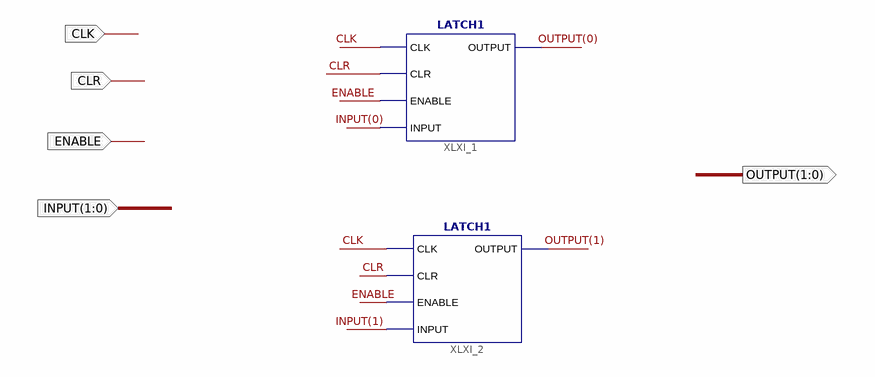
[diagram p0: schematic sheet 1]
// Xilinx ISE schematic LATCH2.sch (artix7) as structural Verilog: 2 symbols, 5 ports
module LATCH2 (
  input  CLK,
  input  CLR,
  input  ENABLE,
  input  [1:0] INPUT,
  output [1:0] OUTPUT
);

  LATCH1 XLXI_1 (.CLK(CLK), .CLR(CLR), .ENABLE(ENABLE), .INPUT(INPUT[0]), .OUTPUT(OUTPUT[0]));
  LATCH1 XLXI_2 (.CLK(CLK), .CLR(CLR), .ENABLE(ENABLE), .INPUT(INPUT[1]), .OUTPUT(OUTPUT[1]));
endmodule
